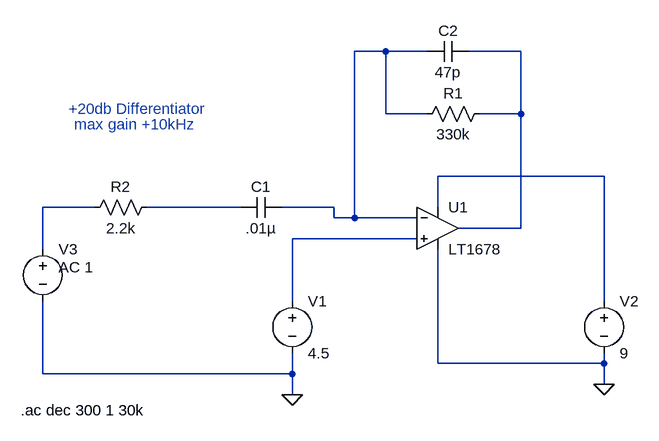
[diagram p0: schematic differentiator.asc]
differentiator.asc, the LTspice schematic file:
Version 4
SHEET 1 880 680
WIRE 352 -336 304 -336
WIRE 416 -336 352 -336
WIRE 560 -336 480 -336
WIRE 352 -240 352 -336
WIRE 416 -240 352 -240
WIRE 560 -240 560 -336
WIRE 560 -240 496 -240
WIRE 688 -144 432 -144
WIRE -96 -96 -176 -96
WIRE 128 -96 -16 -96
WIRE 272 -96 192 -96
WIRE 432 -96 432 -144
WIRE 272 -80 272 -96
WIRE 304 -80 304 -336
WIRE 304 -80 272 -80
WIRE 400 -80 304 -80
WIRE 560 -64 560 -240
WIRE 560 -64 464 -64
WIRE 400 -48 208 -48
WIRE -176 -32 -176 -96
WIRE 208 48 208 -48
WIRE 688 48 688 -144
WIRE 432 144 432 -32
WIRE 688 144 688 128
WIRE 688 144 432 144
WIRE -176 160 -176 48
WIRE 208 160 208 128
WIRE 208 160 -176 160
WIRE 688 176 688 144
WIRE 208 192 208 160
FLAG 688 176 0
FLAG 208 192 0
SYMBOL voltage 208 32 R0
WINDOW 123 0 0 Left 2
WINDOW 39 0 0 Left 2
SYMATTR InstName V1
SYMATTR Value 4.5
SYMBOL voltage 688 32 R0
WINDOW 123 0 0 Left 2
WINDOW 39 0 0 Left 2
SYMATTR InstName V2
SYMATTR Value 9
SYMBOL Opamps\\LT1678 432 -64 R0
SYMATTR InstName U1
SYMBOL res 0 -112 R90
WINDOW 0 0 56 VBottom 2
WINDOW 3 32 56 VTop 2
SYMATTR InstName R2
SYMATTR Value 2.2k
SYMBOL cap 192 -112 R90
WINDOW 0 0 32 VBottom 2
WINDOW 3 32 32 VTop 2
SYMATTR InstName C1
SYMATTR Value .01µ
SYMBOL res 512 -256 R90
WINDOW 0 0 56 VBottom 2
WINDOW 3 32 56 VTop 2
SYMATTR InstName R1
SYMATTR Value 330k
SYMBOL cap 480 -352 R90
WINDOW 0 0 32 VBottom 2
WINDOW 3 32 32 VTop 2
SYMATTR InstName C2
SYMATTR Value 47p
SYMBOL voltage -176 -48 R0
WINDOW 123 24 44 Left 2
WINDOW 39 0 0 Left 2
SYMATTR InstName V3
SYMATTR Value ""
SYMATTR Value2 AC 1
TEXT -210 216 Left 2 !.ac dec 300 1 30k
TEXT -136 -248 Left 2 ;+20db Differentiator
TEXT -128 -224 Left 2 ;max gain +10kHz

The netlist it stands for:
* differentiator.asc
V1 N006 0 4.5
V2 N003 0 9
XU1 N006 N001 N002 N003 0 LT1678  ; pins In+ In- OUT V+ V-
R2 N005 N004 2.2k
C1 N001 N005 .01µ
R1 N002 N001 330k
C2 N002 N001 47p
V3 N004 0 AC 1
.ac dec 300 1 30k
* +20db Differentiator
* max gain +10kHz
.backanno
.end